# EAGLE design DigiSporc (EAGLE 6.2)
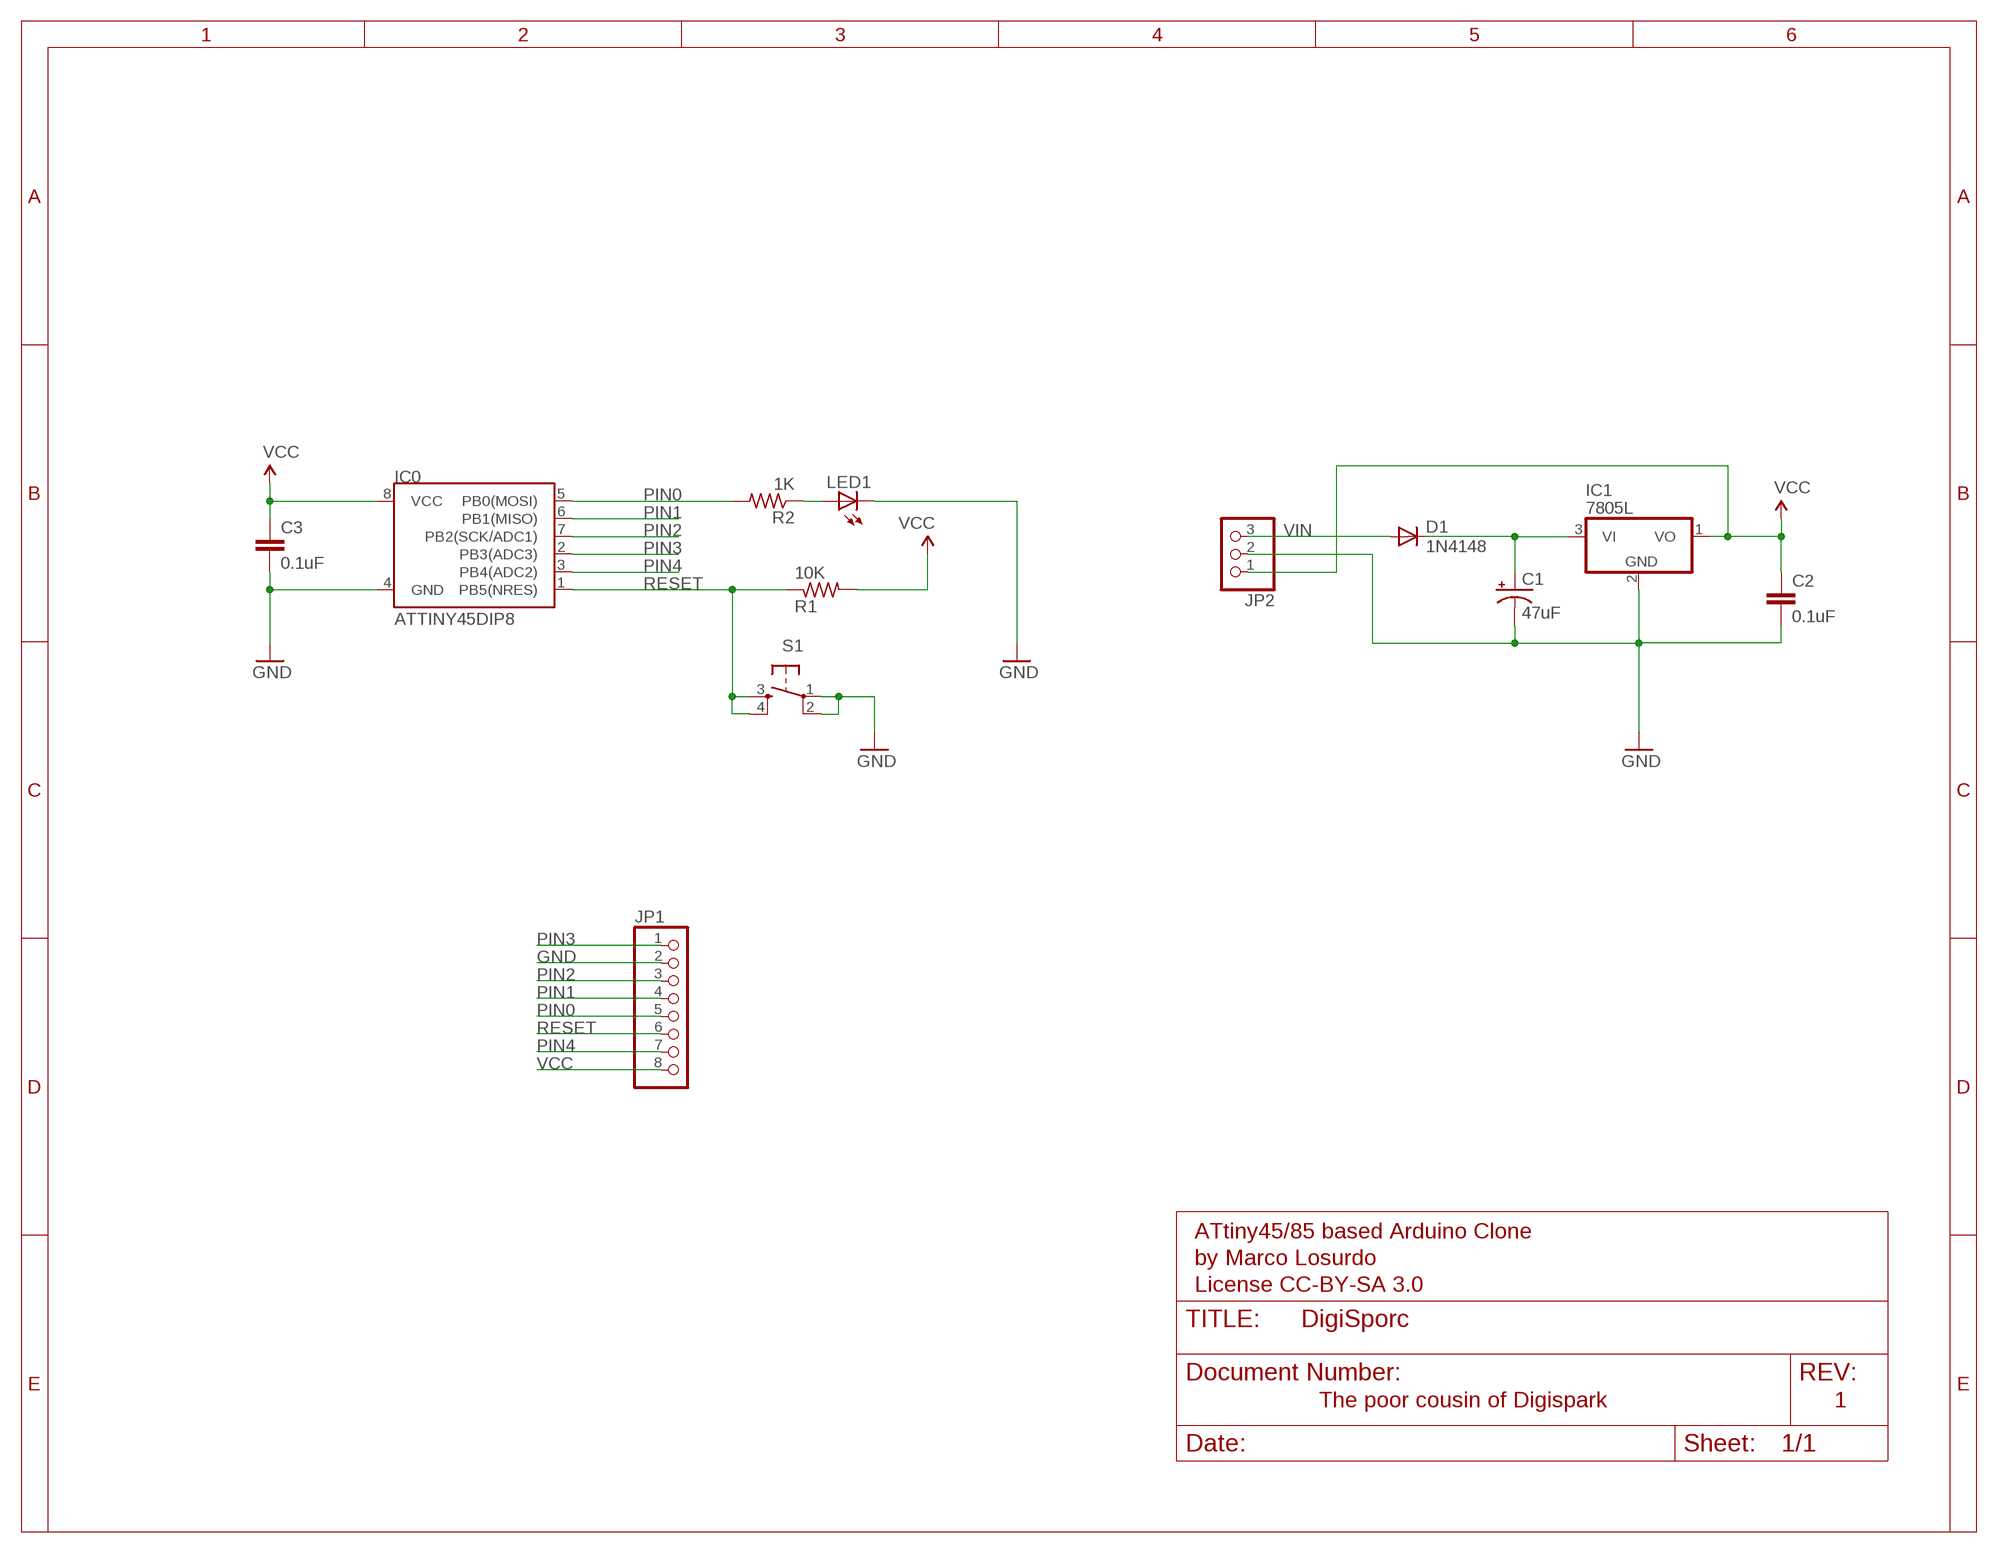
[diagram p0: schematic, sheet 1]

## Parts
C1  47uF  CPOL-USE2-5  [E2-5]
C2  0.1uF  CAPPTH  [CAP-PTH-SMALL]
C3  0.1uF  CAPPTH  [CAP-PTH-SMALL]
D1  1N4148  DIODE-D-5  [D-5]
IC0  ATTINY45DIP8  [DIP08]
IC1  7805L  [TO92]
JP1  PINHD-1X8  [1X08]
JP2  PINHD-1X3  [1X03]
LED1  LED3MM  [LED3MM]
R1  10K  R-US_0204/7  [0204/7]
R2  1K  R-US_0204/7  [0204/7]
S1  TAC_SWITCHPTH  [TACTILE-PTH]

## Nets
GND: C1.- C2.2 C3.2 IC0.4(GND) IC1.2(GND) JP1.2 JP2.2 LED1.K(C) S1.1 S1.2
N$1: C1.+ D1.C IC1.3(VI)
N$5: LED1.A R2.1
PIN0: IC0.5(PB0(MOSI)) JP1.5 R2.2
PIN1: IC0.6(PB1(MISO)) JP1.4
PIN2: IC0.7(PB2(SCK/ADC1)) JP1.3
PIN3: IC0.2(PB3(ADC3)) JP1.1
PIN4: IC0.3(PB4(ADC2)) JP1.7
RESET: IC0.1(PB5(NRES)) JP1.6 R1.1 S1.3 S1.4
VCC: C2.1 C3.1 IC0.8(VCC) IC1.1(VO) JP1.8 JP2.1 R1.2
VIN: D1.A JP2.3

## Notes on the sheet
- ATtiny45/85 based Arduino Clone
- by Marco Losurdo
- License CC-BY-SA 3.0
- The poor cousin of Digispark | 1

## Library data of the parts
C1 = adafruit:CPOL-US: POLARIZED CAPACITOR, American symbol
C2 C3 = SparkFun:CAP: Capacitor Standard 0603 ceramic capacitor, and 0.1" leaded capacitor.
D1 = diode:DIODE-: DIODE
IC0 = SparkFun:ATTINY45: Atmel ATTiny45
IC1 = adafruit:78*: Positive VOLTAGE REGULATOR Added bigger pads to the TO-92 package
JP1 = pinhead:PINHD-1X8: PIN HEADER
JP2 = adafruit:PINHD-1X3: PIN HEADER
LED1 = adafruit:LED: LED OSRAM: - CHIPLED LG R971, LG N971, LY N971, LG Q971, LY Q971, LO R971, LY R971 LH N974, LH R974 LS Q976, LO Q976, LY Q976 LO Q996 - Hyper CHIPLED LW Q18S LB Q993, LB Q99A, LB R99A - SideLED LS A670, LO A670, LY A670, LG A670, LP A670 LB A673, LV A673, LT A673, LW A673 LH A674 LY A675 LS A676, LA A676, LO A676, LY A676, LW A676 LS A679, LY A679, LG A679 - Hyper Micro SIDELED® LS Y876, LA Y876, LO Y876, LY Y876 LT Y87S - SmartLED LW L88C, LW L88S LB L89C, LB L89S, LG L890 LS L89K, LO L89K, LY L89K LS L896, LA L896, LO L896, LY L896 - TOPLED LS T670, LO T670, LY T670, LG T670, LP T670 LSG T670, LSP T670, LSY T670, LOP T670, LYG T670 LG T671, LOG T671, LSG T671 LB T673, LV T673, LT T673, LW T673 LH T674 LS T676, LA T676, LO T676, LY T676, LB T676, LH T676, LSB T676, LW T676 LB T67C, LV T67C, LT T67C, LS T67K, LO T67K, LY T67K, LW E67C LS E67B, LA E67B, LO E67B, LY E67B, LB E67C, LV E67C, LT E67C LW T67C LS T679, LY T679, LG T679 LS T770, LO T770, LY T770, LG T770, LP T770 LB T773, LV T773, LT T773, LW T773 LH T774 LS E675, LA E675, LY E675, LS T675 LS T776, LA T776, LO T776, LY T776, LB T776 LHGB T686 LT T68C, LB T68C - Hyper Mini TOPLED® LB M676 - Mini TOPLED Santana® LG M470 LS M47K, LO M47K, LY M47K Source: http://www.osram.convergy.de/
R1 R2 = adafruit:R-US_: RESISTOR, American symbol
S1 = SparkFun:TAC_SWITCH: Momentary Switch Button commonly used for reset or general input. Spark Fun Electronics SKU : COM-00097

## Board
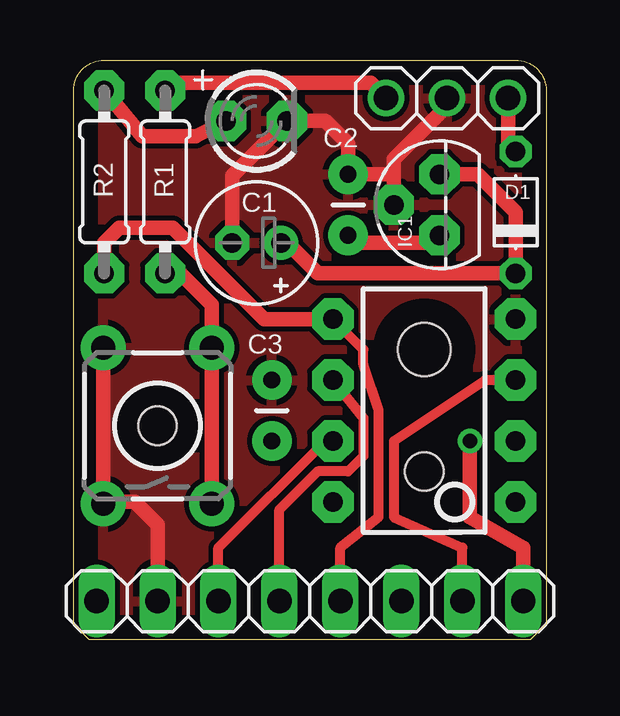
[diagram p1: board, top side]
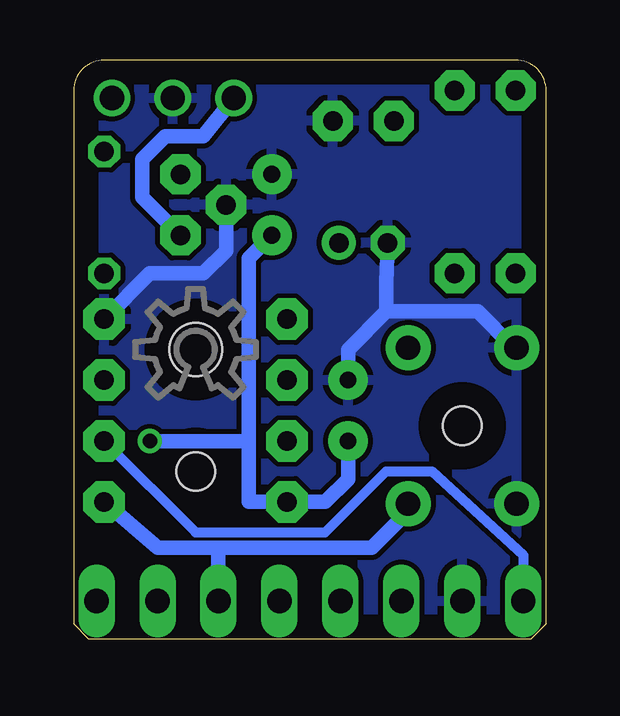
[diagram p2: board, bottom side, seen from below]

Size 19.69 x 24.13 mm. Coordinates in mm from the lower left corner, seen from the top.
Outline: 0,0.63 0.63,0 19.05,0 19.69,0.63 19.69,22.86 arc90 18.41,24.13 1.27,24.13 arc90 0,22.86 0,0.63
Copper layers (1*16): Top 0.035mm / dielectric 1.5mm / Bottom 0.035mm
Design rules: minimum track width 10mil, minimum drill 24mil, track to track 8mil, track to pad 8mil, pad to pad 8mil, via to via 8mil, smd to smd 8mil, copper to edge 40mil, drill to drill 8mil, minimum pad ring 10mil, minimum via ring 8mil, stop-mask expansion 4mil, vias tented up to drill 0mil, thermal gap 10mil
Holes 1.6 mm at 3.49,8.89 14.61,6.98
Holes 2.2 mm at 14.61,12.07

### Footprints (pad centres in the part's own frame; a part is rotated, then mirrored left to right if it is on the bottom)
E2-5 = drill 0.813 pad 1.422: + -1.016,0 | drill 0.813 pad 1.422 octagon: - 1.016,0
CAP-PTH-SMALL = drill 0.7 pad 1.651: 1 0,0; 2 2.54,0
D-5 = drill 0.813 octagon: A 2.54,0; C -2.54,0
DIP08 = drill 0.813 pad 1.727 octagon: 1 -3.81,-3.81; 2 -1.27,-3.81; 3 1.27,-3.81; 4 3.81,-3.81; 5 3.81,3.81; 6 1.27,3.81; 7 -1.27,3.81; 8 -3.81,3.81
TO92 = drill 0.813 pad 1.676 octagon: 1 -1.27,0; 2 0,1.905; 3 1.27,0
1X08 = drill 1.016 long: 1 -8.89,0; 2 -6.35,0; 3 -3.81,0; 4 -1.27,0; 5 1.27,0; 6 3.81,0; 7 6.35,0; 8 8.89,0
1X03 = drill 1.016: 1 -2.54,0; 2 0,0; 3 2.54,0
LED3MM = drill 0.813 pad 1.676 octagon: A -1.27,0; K 1.27,0
0204/7 = drill 0.813 pad 1.676 octagon: 1 -3.81,0; 2 3.81,0
TACTILE-PTH = drill 1.016 pad 1.88: 1 -3.251,2.261; 2 3.251,2.261; 3 -3.251,-2.261; 4 3.251,-2.261

### Placement (x,y rotation side)
C1  7.62,16.51 180 top
C2  11.43,16.83 90 top
C3  8.25,8.25 90 top
D1  18.41,17.78 90 top
IC0  14.61,9.52 90 top
IC1  15.24,18.1 90 top
JP1  9.84,1.59 0 top
JP2  15.56,22.54 0 top
LED1  7.62,21.59 0 top
R1  3.81,19.05 90 top
R2  1.27,19.05 270 top
S1  3.49,8.89 90 top
U$1  [OSHWLOGO_TOL_0.2]  14.61,12.07 0 bottom

### Tracks (layer width: path | path; a pad name or v marks a point on that pad's centre or on a via)
GND
  Top 0.61: S1.2 S1.1 1.83,5.64 1.9,5.71 2.54,5.71 3.49,4.76 JP1.2 | C1.- 6.6,19.3 LED1.K 10.48,21.59 11.43,20.64 C2.2 13.34,19.37 | JP2.2 15.56,22.22 13.34,20 13.34,19.37 | 13.34,19.37 IC1.2
  Bottom 0.61: S1.2 1.35,12.14 2.86,13.65 6.67,13.65 | 6.67,13.65 6.67,14.86 C1.- | 6.67,13.65 8.25,12.07 C3.2 | IC0.4 16.51,15.24 14.29,15.24 13.34,16.19 IC1.2
  pour Bottom: 0,24.13 19.69,24.13 19.69,0 0,0
  pour Top: 0,24.13 19.69,24.13 19.69,0 0,0
N$1
  Top 0.61: IC1.3 16.83,19.37 18.41,17.78 D1.C 10.16,15.24 8.95,16.45 C1.+
N$5
  Top 0.61: R2.1 2.86,20.95 5.08,20.95 LED1.A
PIN0
  Top 0.406: IC0.5 12.06,12.07 12.06,11.43 12.7,9.52 12.7,5.08 11.11,3.81 JP1.5
  Top 0.61: IC0.5 7.94,13.34 4.13,17.14 1.9,17.14 1.27,16.51 R2.2
PIN1
  Top 0.406: IC0.6 12.06,9.21 12.06,7.62 11.43,6.98 10.16,6.98 8.57,5.4 JP1.4
PIN2
  Top 0.406: IC0.7 10.48,8.25 6.03,3.81 JP1.3
PIN3
  Bottom 0.406: IC0.2 14.61,4.45 9.21,4.45 6.67,6.98 4.76,6.98 0.95,3.49 JP1.1
PIN4
  Top 0.406: IC0.3 17.14,10.79 13.34,8.25 13.34,5.08 16.19,3.81 JP1.7
RESET
  Top 0.61: S1.3 S1.4 5.75,13.93 4.45,15.24 R1.1
  Bottom 0.61: 13.65,3.81 7.26,3.81 5.75,5.32 S1.3 | IC0.1 16.19,3.81 13.65,3.81 | 13.65,3.81 JP1.6
VCC  (via drill 0.6)
  Top 0.61: R1.2 4.13,23.18 12.38,23.18 JP2.1 | C2.1 11.75,16.51 14.92,16.51 IC1.1 | v16.51,8.25 16.51,5.08 18.73,3.81 JP1.8
  Bottom 0.61: C3.1 8.25,6.67 9.21,5.71 IC0.8 12.38,5.71 12.38,8.25 | JP2.1 14.29,20.95 15.88,20.95 16.83,20 16.83,18.41 IC1.1 | 12.38,8.25 12.38,15.88 C2.1 | 12.38,8.25 v16.51,8.25
VIN
  Top 0.61: JP2.3 18.1,20.64 D1.A

### Text on the board
tDocu: 5V | GND | VIN | 3 | GND | 2 | 1 | 0 | RST | 4 | 5V